# EAGLE schematic goJAMMAv02 (EAGLE 9.3.1)
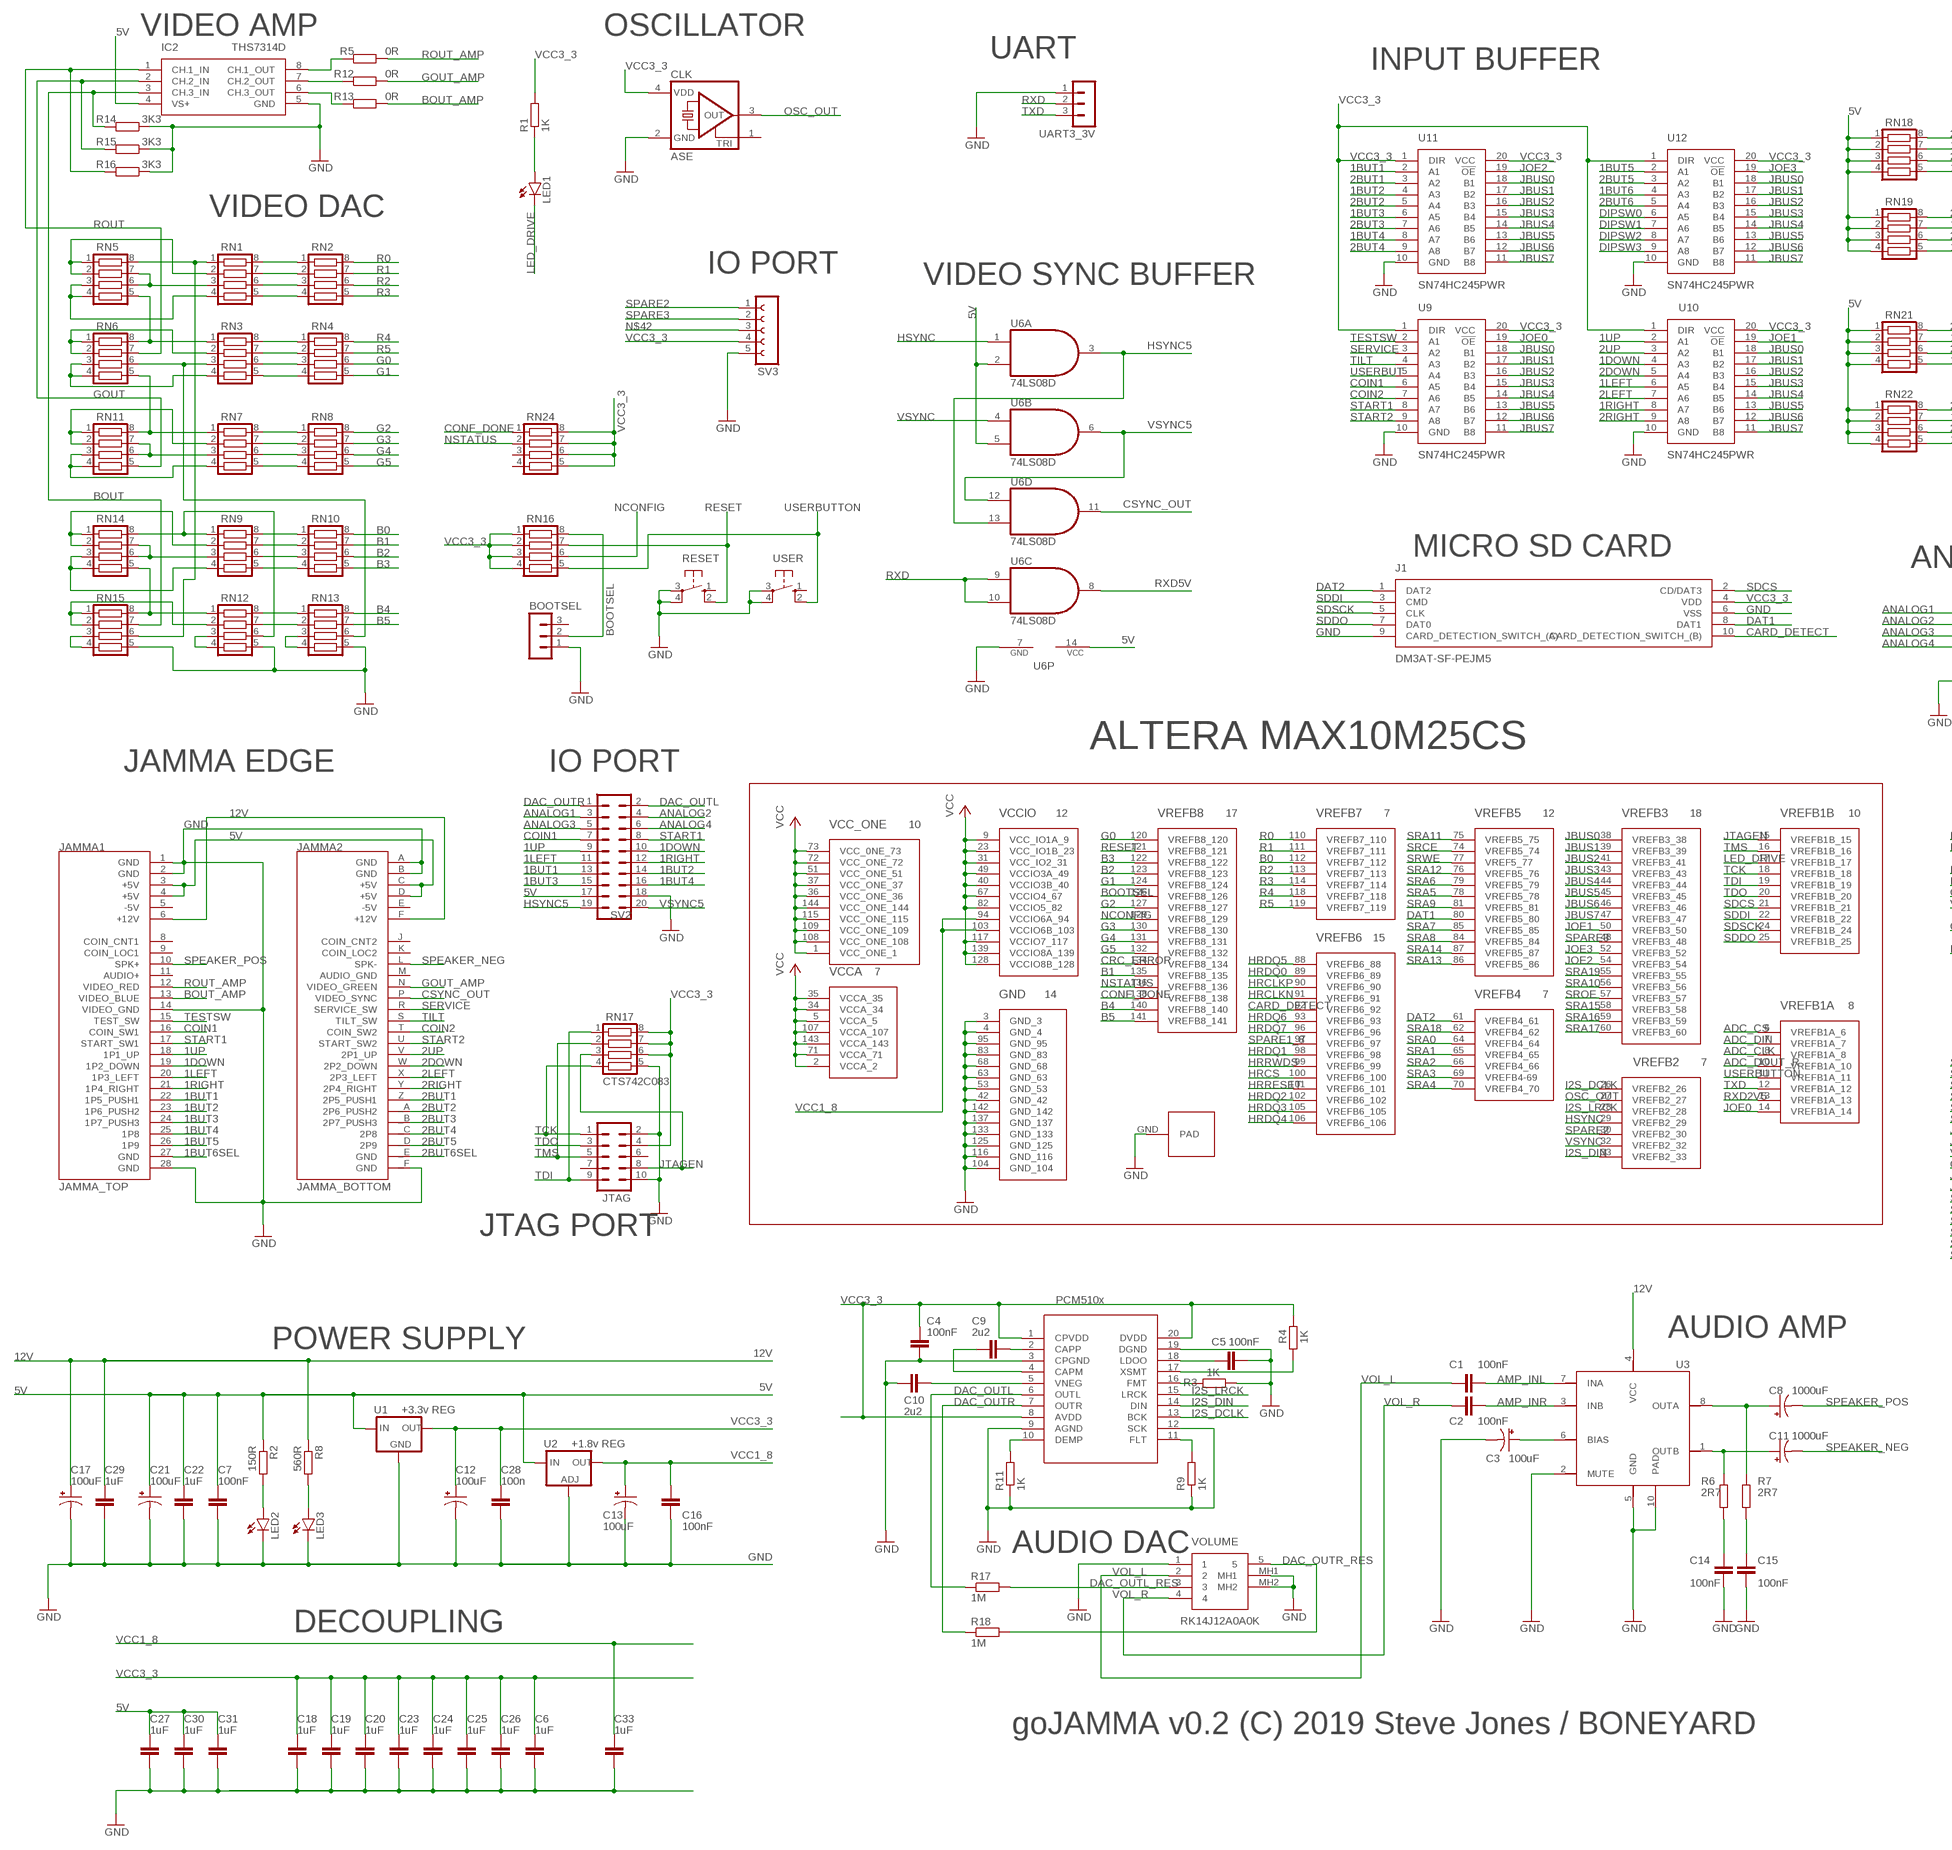
[diagram p0: schematic, sheet 1, part 1 of 2]
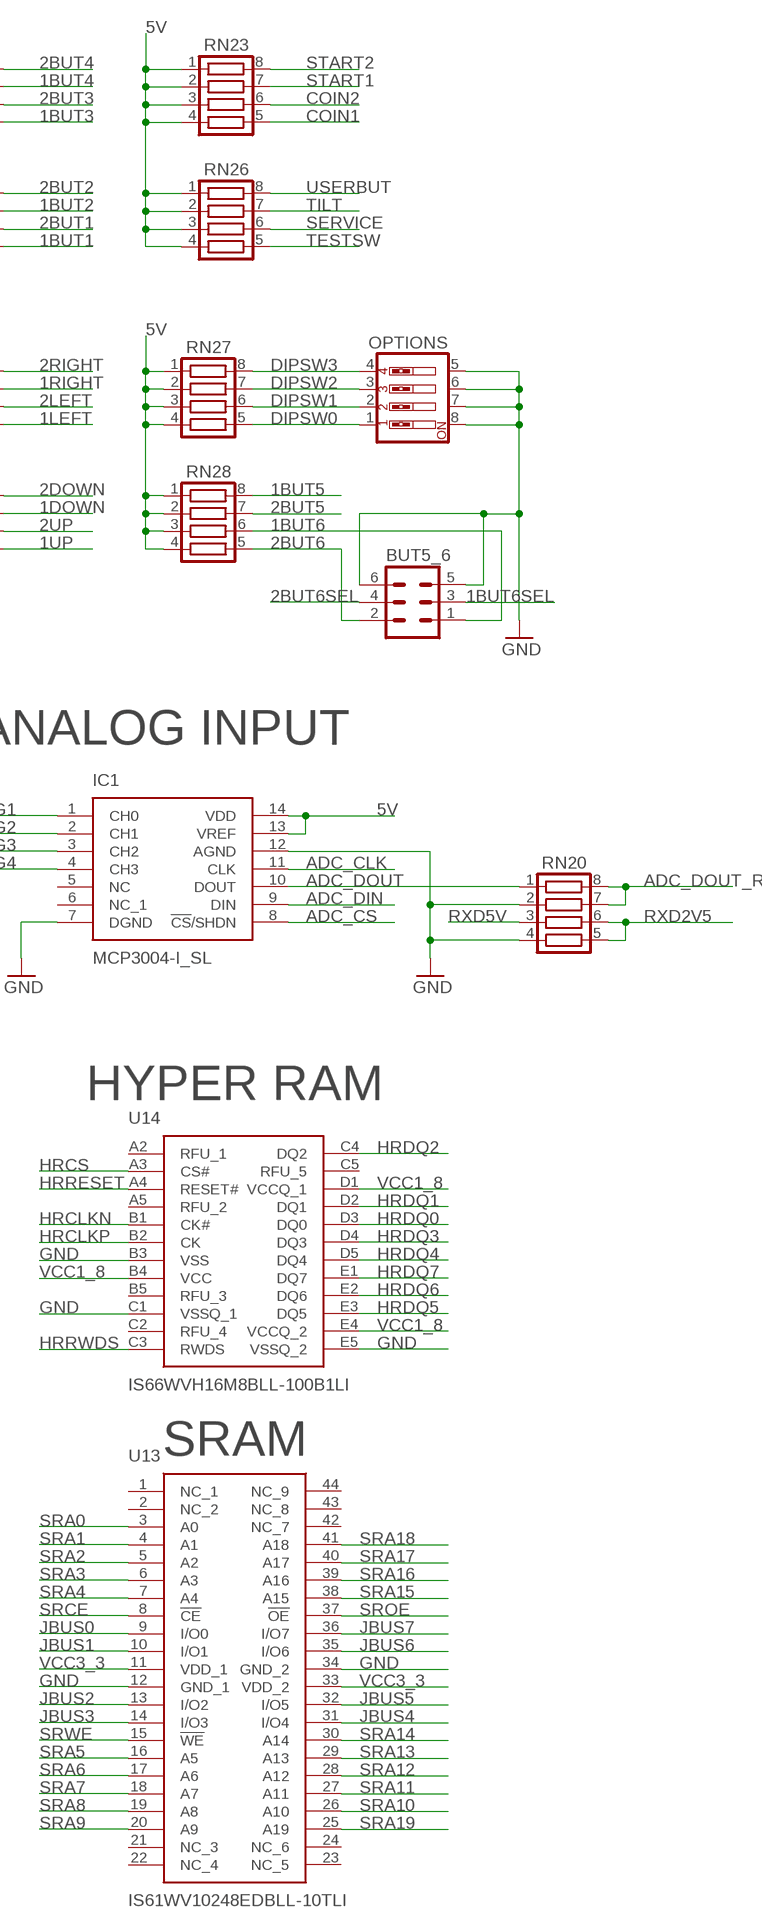
[diagram p1: schematic, sheet 1, part 2 of 2]

## Parts
BOOTSEL  MA03-1  [MA03-1]
BUT5_6  MA03-2  [MA03-2]
C1  100nF  C-EUC0805K  [C0805K]
C2  100nF  C-EUC0805K  [C0805K]
C3  100uF  100UF-POLAR-RADIAL-2.5MM-25V-20%  [CPOL-RADIAL-2.5MM-6.5MM]
C4  100nF  C-EUC0805K  [C0805K]
C5  100nF  C-EUC0805K  [C0805K]
C6  1uF  C-EUC0805K  [C0805K]
C7  100nF  C-EUC0805K  [C0805K]
C8  1000uF  1000UF-RADIAL-5MM-25V-20%  [CPOL-RADIAL-5MM-10MM]
C9  2u2  C-EUC0805K  [C0805K]
C10  2u2  C-EUC0805K  [C0805K]
C11  1000uF  1000UF-RADIAL-5MM-25V-20%  [CPOL-RADIAL-5MM-10MM]
C12  100uF  1000UF-RADIAL-5MM-25V-20%  [CPOL-RADIAL-5MM-10MM]
C13  100uF  1000UF-RADIAL-5MM-25V-20%  [CPOL-RADIAL-5MM-10MM]
C14  100nF  C-EUC0805K  [C0805K]
C15  100nF  C-EUC0805K  [C0805K]
C16  100nF  C-EUC0805K  [C0805K]
C17  100uF  1000UF-RADIAL-5MM-25V-20%  [CPOL-RADIAL-5MM-10MM]
C18  1uF  C-EUC0805K  [C0805K]
C19  1uF  C-EUC0805K  [C0805K]
C20  1uF  C-EUC0805K  [C0805K]
C21  100uF  1000UF-RADIAL-5MM-25V-20%  [CPOL-RADIAL-5MM-10MM]
C22  1uF  C-EUC0805K  [C0805K]
C23  1uF  C-EUC0805K  [C0805K]
C24  1uF  C-EUC0805K  [C0805K]
C25  1uF  C-EUC0805K  [C0805K]
C26  1uF  C-EUC0805K  [C0805K]
C27  1uF  C-EUC0805K  [C0805K]
C28  100n  C-EUC0805K  [C0805K]
C29  1uF  C-EUC0805K  [C0805K]
C30  1uF  C-EUC0805K  [C0805K]
C31  1uF  C-EUC0805K  [C0805K]
C33  1uF  C-EUC0805K  [C0805K]
CLK  ASE  [ASE]
IC1  MCP3004-I_SL  [SOIC127P600X175-14N]
IC2  THS7314D  [SOIC127P600X175-8N]
J1  DM3AT-SF-PEJM5  [DM3AT-SF-PEJM5_1]
JAMMA1  JAMMA_TOP  [JAMMA_TOP]
JAMMA2  JAMMA_BOTTOM  [JAMMA_BOTTOM]
JTAG  MA05-2  [MA05-2]
LED1  LEDCHIPLED_0805  [CHIPLED_0805]
LED2  LEDCHIPLED_0805  [CHIPLED_0805]
LED3  LEDCHIPLED_0805  [CHIPLED_0805]
OPTIONS  SW_DIP-4  [EDG-04]
R1  1K  R-EU_R0805  [R0805]
R2  150R  R-EU_R0805  [R0805]
R3  1K  R-EU_R0805  [R0805]
R4  1K  R-EU_R0805  [R0805]
R5  0R  R-EU_R0805  [R0805]
R6  2R7  R-EU_R0805  [R0805]
R7  2R7  R-EU_R0805  [R0805]
R8  560R  R-EU_R0805  [R0805]
R9  1K  R-EU_R0805  [R0805]
R11  1K  R-EU_R0805  [R0805]
R12  0R  R-EU_R0805  [R0805]
R13  0R  R-EU_R0805  [R0805]
R14  3K3  R-EU_R0805  [R0805]
R15  3K3  R-EU_R0805  [R0805]
R16  3K3  R-EU_R0805  [R0805]
R17  1M  R-EU_R0805  [R0805]
R18  1M  R-EU_R0805  [R0805]
RESET  10-XX  [B3F-10XX]
RN1  CTS742C083  [CTS742C083]
RN2  CTS742C083  [CTS742C083]
RN3  CTS742C083  [CTS742C083]
RN4  CTS742C083  [CTS742C083]
RN5  CTS742C083  [CTS742C083]
RN6  CTS742C083  [CTS742C083]
RN7  CTS742C083  [CTS742C083]
RN8  CTS742C083  [CTS742C083]
RN9  CTS742C083  [CTS742C083]
RN10  CTS742C083  [CTS742C083]
RN11  CTS742C083  [CTS742C083]
RN12  CTS742C083  [CTS742C083]
RN13  CTS742C083  [CTS742C083]
RN14  CTS742C083  [CTS742C083]
RN15  CTS742C083  [CTS742C083]
RN16  CTS742C083  [CTS742C083]
RN17  CTS742C083  [CTS742C083]
RN18  CTS742C083  [CTS742C083]
RN19  CTS742C083  [CTS742C083]
RN20  CTS742C083  [CTS742C083]
RN21  CTS742C083  [CTS742C083]
RN22  CTS742C083  [CTS742C083]
RN23  CTS742C083  [CTS742C083]
RN24  CTS742C083  [CTS742C083]
RN26  CTS742C083  [CTS742C083]
RN27  CTS742C083  [CTS742C083]
RN28  CTS742C083  [CTS742C083]
SV2  MA10-2  [MA10-2]
SV3  FE05-1  [FE05-1]
U1  +3.3v REG  V_REG_78XX7812  [TO-252]
U2  +1.8v REG  V_REG_LM1117SOT223  [SOT223]
U3  LM4755  [DDPAK-9]
U4  PCM5101  [TSSOP20]
U6  74LS08D  [SO14]
U8  ALTERA_MAX10M25SCPAD  [ALTERA_EQFP144]
U9  SN74HC245PWR  [SOP65P640X120-20N]
U10  SN74HC245PWR  [SOP65P640X120-20N]
U11  SN74HC245PWR  [SOP65P640X120-20N]
U12  SN74HC245PWR  [SOP65P640X120-20N]
U13  IS61WV10248EDBLL-10TLI  [SOP80P1176X120-44N]
U14  IS66WVH16M8BLL-100B1LI  [BGA24C100P5X5_600X800X120]
UART3_3V  MA03-1  [MA03-1]
USER  10-XX  [B3F-10XX]
VOLUME  RK14J12A0A0K  [RK14J12A0A0K]

## Nets
1BUT1: JAMMA1.22(1P5_PUSH1) RN19.5 SV2.13 U11.2(A1)
1BUT2: JAMMA1.23(1P6_PUSH2) RN19.7 SV2.14 U11.4(A3)
1BUT3: JAMMA1.24(1P7_PUSH3) RN18.5 SV2.15 U11.6(A5)
1BUT4: JAMMA1.25(1P8) RN18.7 SV2.16 U11.8(A7)
1BUT5: JAMMA1.26(1P9) RN28.8 U12.2(A1)
1BUT6: BUT5_6.1 RN28.6 U12.4(A3)
1BUT6SEL: BUT5_6.3 JAMMA1.27(GND)
1DOWN: JAMMA1.19(1P2_DOWN) RN22.7 SV2.10 U10.4(A3)
1LEFT: JAMMA1.20(1P3_LEFT) RN21.5 SV2.11 U10.6(A5)
1RIGHT: JAMMA1.21(1P4_RIGHT) RN21.7 SV2.12 U10.8(A7)
1UP: JAMMA1.18(1P1_UP) RN22.5 SV2.9 U10.2(A1)
2BUT1: JAMMA2.Z(2P5_PUSH1) RN19.6 U11.3(A2)
2BUT2: JAMMA2._A(2P6_PUSH2) RN19.8 U11.5(A4)
2BUT3: JAMMA2._B(2P7_PUSH3) RN18.6 U11.7(A6)
2BUT4: JAMMA2._C(2P8) RN18.8 U11.9(A8)
2BUT5: JAMMA2._D(2P9) RN28.7 U12.3(A2)
2BUT6: BUT5_6.2 RN28.5 U12.5(A4)
2BUT6SEL: BUT5_6.4 JAMMA2._E(GND)
2DOWN: JAMMA2.W(2P2_DOWN) RN22.8 U10.5(A4)
2LEFT: JAMMA2.X(2P3_LEFT) RN21.6 U10.7(A6)
2RIGHT: JAMMA2.Y(2P4_RIGHT) RN21.8 U10.9(A8)
2UP: JAMMA2.V(2P1_UP) RN22.6 U10.3(A2)
5V: C7.1 C21.+ C22.1 C27.1 C30.1 C31.1 IC1.13(VREF) IC1.14(VDD) IC2.4(VS+) JAMMA1.3(+5V) JAMMA1.4(+5V) JAMMA2.C(+5V) JAMMA2.D(+5V) R2.1 RN18.1 RN18.2 RN18.3 RN18.4 RN19.1 RN19.2 RN19.3 RN19.4 RN21.1 RN21.2 RN21.3 RN21.4 RN22.1 RN22.2 RN22.3 RN22.4 RN23.1 RN23.2 RN23.3 RN23.4 RN26.1 RN26.2 RN26.3 RN26.4 RN27.1 RN27.2 RN27.3 RN27.4 RN28.1 RN28.2 RN28.3 RN28.4 SV2.17 U1.1(IN) U2.3(IN) U6.2(A:I1) U6.5(B:I1) U6.14(P:VCC)
12V: C17.+ C29.1 JAMMA1.6(+12V) JAMMA2.F(+12V) R8.1 U3.4(VCC)
ADC_CLK: IC1.11(CLK) U8.8(VREFB1A_8)
ADC_CS: IC1.8(!CS!/SHDN) U8.6(VREFB1A_6)
ADC_DIN: IC1.9(DIN) U8.7(VREFB1A_7)
ADC_DOUT: IC1.10(DOUT) RN20.1
ADC_DOUT_R: RN20.7 RN20.8 U8.10(VREFB1A_10)
AMP_INL: C1.2 U3.7(INA)
AMP_INR: C2.2 U3.3(INB)
ANALOG1: IC1.1(CH0) SV2.3
ANALOG2: IC1.2(CH1) SV2.4
ANALOG3: IC1.3(CH2) SV2.5
ANALOG4: IC1.4(CH3) SV2.6
B0: RN10.8 U8.112(VREFB7_112)
B1: RN10.7 U8.135(VREFB8_135)
B2: RN10.6 U8.123(VREFB8_123)
B3: RN10.5 U8.122(VREFB8_122)
B4: RN13.8 U8.140(VREFB8_140)
B5: RN13.7 U8.141(VREFB8_141)
BOOTSEL: BOOTSEL.2 RN16.8 U8.126(VREFB8_126)
BOUT: IC2.3(CH.3_IN) R14.2 RN15.7
BOUT_AMP: JAMMA1.13(VIDEO_BLUE) R13.2
CARD_DETECT: J1.10(CARD_DETECTION_SWITCH_(B)) U8.92(VREFB6_92)
COIN1: JAMMA1.16(COIN_SW1) RN23.5 SV2.7 U9.6(A5)
COIN2: JAMMA2.T(COIN_SW2) RN23.6 U9.7(A6)
CONF_DONE: RN24.1 U8.138(VREFB8_138)
CRC_ERROR: U8.134(VREFB8_134)
CSYNC_OUT: JAMMA2.P(VIDEO_SYNC) U6.11(D:O)
DAC_OUTL: R17.1 SV2.2 U4.6(OUTL)
DAC_OUTL_RES: R17.2 VOLUME.3
DAC_OUTR: R18.1 SV2.1 U4.7(OUTR)
DAC_OUTR_RES: R18.2 VOLUME.5
DAT1: J1.8(DAT1) U8.80(VREFB5_80)
DAT2: J1.1(DAT2) U8.61(VREFB4_61)
DIPSW0: OPTIONS.1 RN27.5 U12.6(A5)
DIPSW1: OPTIONS.2 RN27.6 U12.7(A6)
DIPSW2: OPTIONS.3 RN27.7 U12.8(A7)
DIPSW3: OPTIONS.4 RN27.8 U12.9(A8)
G0: RN4.6 U8.120(VREFB8_120)
G1: RN4.5 U8.124(VREFB8_124)
G2: RN8.8 U8.127(VREFB8_127)
G3: RN8.7 U8.130(VREFB8_130)
G4: RN8.6 U8.131(VREFB8_131)
G5: RN8.5 U8.132(VREFB8_132)
GND: BOOTSEL.1 BUT5_6.5 BUT5_6.6 C3.2(-) C4.2 C5.2 C6.2 C7.2 C10.2 C12.- C13.- C14.2 C15.2 C16.2 C17.- C18.2 C19.2 C20.2 C21.- C22.2 C23.2 C24.2 C25.2 C26.2 C27.2 C28.2 C29.2 C30.2 C31.2 C33.2 CLK.2(GND) IC1.7(DGND) IC1.12(AGND) IC2.5(GND) J1.6(VSS) J1.9(CARD_DETECTION_SWITCH_(A)) JAMMA1.1(GND) JAMMA1.2(GND) JAMMA1.14(VIDEO_GND) JAMMA1.28(GND) JAMMA2._F(GND) JAMMA2.A(GND) JAMMA2.B(GND) JTAG.2 JTAG.10 LED2.C LED3.C OPTIONS.5 OPTIONS.6 OPTIONS.7 OPTIONS.8 R3.1 R9.1 R11.1 R14.1 R15.1 R16.1 RESET.3(P) RESET.4(P1) RN12.5 RN13.5 RN15.5 RN17.5 RN20.2 RN20.4 SV2.18 SV3.5 U1.3(GND) U2.1(ADJ) U3.2(MUTE) U3.5(GND) U3.10(PAD) U4.3(CPGND) U4.9(AGND) U4.12(SCK) U4.19(DGND) U6.7(P:GND) U8.3(GND_3) U8.4(GND_4) U8.42(GND_42) U8.53(GND_53) U8.63(GND_63) U8.68(GND_68) U8.83(GND_83) U8.95(GND_95) U8.104(GND_104) U8.116(GND_116) U8.125(GND_125) U8.133(GND_133) U8.137(GND_137) U8.142(GND_142) U8.GND(PAD) U9.10(GND) U10.10(GND) U11.10(GND) U12.10(GND) U13.12(GND_1) U13.34(GND_2) U14.B3(VSS) U14.C1(VSSQ_1) U14.E5(VSSQ_2) UART3_3V.1 USER.3(P) USER.4(P1) VOLUME.1 VOLUME.MH1 VOLUME.MH2
GOUT: IC2.2(CH.2_IN) R15.2 RN11.5
GOUT_AMP: JAMMA2.N(VIDEO_GREEN) R12.2
HRCLKN: U8.91(VREFB6_91) U14.B1(CK#)
HRCLKP: U8.90(VREFB6_90) U14.B2(CK)
HRCS: U8.100(VREFB6_100) U14.A3(CS#)
HRDQ0: U8.89(VREFB6_89) U14.D3(DQ0)
HRDQ1: U8.98(VREFB6_98) U14.D2(DQ1)
HRDQ2: U8.102(VREFB6_102) U14.C4(DQ2)
HRDQ3: U8.105(VREFB6_105) U14.D4(DQ3)
HRDQ4: U8.106(VREFB6_106) U14.D5(DQ4)
HRDQ5: U8.88(VREFB6_88) U14.E3(DQ5)
HRDQ6: U8.93(VREFB6_93) U14.E2(DQ6)
HRDQ7: U8.96(VREFB6_96) U14.E1(DQ7)
HRRESET: U8.101(VREFB6_101) U14.A4(RESET#)
HRRWDS: U8.99(VREFB6_99) U14.C3(RWDS)
HSYNC: U6.1(A:I0) U8.29(VREFB2_29)
HSYNC5: SV2.19 U6.3(A:O) U6.13(D:I1)
I2S_DCLK: U4.13(BCK) U8.26(VREFB2_26)
I2S_DIN: U4.14(DIN) U8.33(VREFB2_33)
I2S_LRCK: U4.15(LRCK) U8.28(VREFB2_28)
JBUS0: U8.38(VREFB3_38) U9.18(B1) U10.18(B1) U11.18(B1) U12.18(B1) U13.9(I/O0)
JBUS1: U8.39(VREFB3_39) U9.17(B2) U10.17(B2) U11.17(B2) U12.17(B2) U13.10(I/O1)
JBUS2: U8.41(VREFB3_41) U9.16(B3) U10.16(B3) U11.16(B3) U12.16(B3) U13.13(I/O2)
JBUS3: U8.43(VREFB3_43) U9.15(B4) U10.15(B4) U11.15(B4) U12.15(B4) U13.14(I/O3)
JBUS4: U8.44(VREFB3_44) U9.14(B5) U10.14(B5) U11.14(B5) U12.14(B5) U13.31(I/O4)
JBUS5: U8.45(VREFB3_45) U9.13(B6) U10.13(B6) U11.13(B6) U12.13(B6) U13.32(I/O5)
JBUS6: U8.46(VREFB3_46) U9.12(B7) U10.12(B7) U11.12(B7) U12.12(B7) U13.35(I/O6)
JBUS7: U8.47(VREFB3_47) U9.11(B8) U10.11(B8) U11.11(B8) U12.11(B8) U13.36(I/O7)
JOE0: U8.14(VREFB1A_14) U9.19(!OE)
JOE1: U8.50(VREFB3_50) U10.19(!OE)
JOE2: U8.54(VREFB3_54) U11.19(!OE)
JOE3: U8.52(VREFB3_52) U12.19(!OE)
JTAGEN: JTAG.8 RN17.3 U8.15(VREFB1B_15)
LED_DRIVE: LED1.C U8.17(VREFB1B_17)
N$1: RN1.8 RN2.1
N$3: C8.+ R7.2 U3.8(OUTA)
N$4: RN1.7 RN2.2
N$5: RN1.6 RN2.3
N$6: RN1.5 RN2.4
N$7: RN3.8 RN4.1
N$8: RN3.7 RN4.2
N$9: RN7.8 RN8.1
N$10: RN7.7 RN8.2
N$11: RN7.6 RN8.3
N$12: RN7.5 RN8.4
N$13: RN6.5 RN7.1 RN11.8
N$14: RN9.8 RN10.1
N$15: RN1.1 RN5.8 RN15.6
N$16: RN1.2 RN5.1 RN5.2
N$17: RN1.3 RN5.6 RN5.7
N$18: RN1.4 RN5.3 RN5.4
N$19: RN3.1 RN5.5 RN6.8
N$20: RN3.2 RN6.1 RN6.2
N$21: RN9.7 RN10.2
N$22: RN7.2 RN11.1 RN11.2
N$23: RN7.3 RN11.6 RN11.7
N$24: RN7.4 RN11.3 RN11.4
N$25: RN9.6 RN10.3
N$26: RN9.5 RN10.4
N$27: RN3.4 RN6.3 RN6.4
N$28: RN12.8 RN13.1
N$29: RN3.6 RN4.3
N$30: RN3.5 RN4.4
N$31: RN3.3 RN6.6 RN13.6
N$32: RN12.7 RN13.2
N$33: RN9.1 RN12.6 RN14.8
N$34: RN9.2 RN14.1 RN14.2
N$35: RN9.3 RN14.6 RN14.7
N$36: RN9.4 RN14.3 RN14.4
N$37: RN12.1 RN14.5 RN15.8
N$38: RN12.2 RN15.1 RN15.2
N$39: RN15.3 RN15.4
N$40: RN12.3 RN12.4
N$41: RN13.3 RN13.4
N$42: SV3.3
N$43: R3.2 U4.16(FMT)
N$47: IC2.8(CH.1_OUT) R5.1
N$48: LED1.A R1.1
N$49: IC2.7(CH.2_OUT) R12.1
N$50: IC2.6(CH.3_OUT) R13.1
N$52: LED2.A R2.2
N$53: LED3.A R8.2
N$55: C9.2 U4.2(CAPP)
N$57: C9.1 U4.4(CAPM)
N$58: C11.+ R6.2 U3.1(OUTB)
N$59: C3.1(+) U3.6(BIAS)
N$61: C14.1 R6.1
N$62: C15.1 R7.1
N$66: C10.1 U4.5(VNEG)
N$78: R4.1 U4.17(XSMT)
N$80: R11.2 U4.10(DEMP)
N$81: R9.2 U4.11(FLT)
N$82: C5.1 U4.18(LDOO)
NCONFIG: RN16.6 U8.129(VREFB8_129)
NSTATUS: RN24.2 U8.136(VREFB8_136)
OSC_OUT: CLK.3(OUT) U8.27(VREFB2_27)
R0: RN2.8 U8.110(VREFB7_110)
R1: RN2.7 U8.111(VREFB7_111)
R2: RN2.6 U8.113(VREFB7_113)
R3: RN2.5 U8.114(VREFB7_114)
R4: RN4.8 U8.118(VREFB7_118)
R5: RN4.7 U8.119(VREFB7_119)
RESET: RESET.2(S1) RN16.7 U8.121(VREFB8_121)
ROUT: IC2.1(CH.1_IN) R16.2 RN6.7
ROUT_AMP: JAMMA1.12(VIDEO_RED) R5.2
RXD: U6.9(C:I0) U6.10(C:I1) UART3_3V.2
RXD2V5: RN20.5 RN20.6 U8.13(VREFB1A_13)
RXD5V: RN20.3 U6.8(C:O)
SDCS: J1.2(CD/DAT3) U8.21(VREFB1B_21)
SDDI: J1.3(CMD) U8.22(VREFB1B_22)
SDDO: J1.7(DAT0) U8.25(VREFB1B_25)
SDSCK: J1.5(CLK) U8.24(VREFB1B_24)
SERVICE: JAMMA2.R(SERVICE_SW) RN26.6 U9.3(A2)
SPARE1_8: U8.97(VREFB6_97)
SPARE2: SV3.1 U8.30(VREFB2_30)
SPARE3: SV3.2 U8.48(VREFB3_48)
SPEAKER_NEG: C11.- JAMMA2.L(SPK-)
SPEAKER_POS: C8.- JAMMA1.10(SPK+)
SRA0: U8.64(VREFB4_64) U13.3(A0)
SRA1: U8.65(VREFB4_65) U13.4(A1)
SRA2: U8.66(VREFB4_66) U13.5(A2)
SRA3: U8.69(VREFB4-69) U13.6(A3)
SRA4: U8.70(VREFB4_70) U13.7(A4)
SRA5: U8.78(VREFB5_78) U13.16(A5)
SRA6: U8.79(VREFB5_79) U13.17(A6)
SRA7: U8.85(VREFB5_85) U13.18(A7)
SRA8: U8.84(VREFB5_84) U13.19(A8)
SRA9: U8.81(VREFB5_81) U13.20(A9)
SRA10: U8.56(VREFB3_56) U13.26(A10)
SRA11: U8.75(VREFB5_75) U13.27(A11)
SRA12: U8.76(VREFB5_76) U13.28(A12)
SRA13: U8.86(VREFB5_86) U13.29(A13)
SRA14: U8.87(VREFB5_87) U13.30(A14)
SRA15: U8.58(VREFB3_58) U13.38(A15)
SRA16: U8.59(VREFB3_59) U13.39(A16)
SRA17: U8.60(VREFB3_60) U13.40(A17)
SRA18: U8.62(VREFB4_62) U13.41(A18)
SRA19: U8.55(VREFB3_55) U13.25(A19)
SRCE: U8.74(VREFB5_74) U13.8(!CE)
SROE: U8.57(VREFB3_57) U13.37(!OE)
SRWE: U8.77(VREF5_77) U13.15(!WE)
START1: JAMMA1.17(START_SW1) RN23.7 SV2.8 U9.8(A7)
START2: JAMMA2.U(START_SW2) RN23.8 U9.9(A8)
TCK: JTAG.1 RN17.4 U8.18(VREFB1B_18)
TDI: JTAG.9 RN17.1 U8.19(VREFB1B_19)
TDO: JTAG.3 U8.20(VREFB1B_20)
TESTSW: JAMMA1.15(TEST_SW) RN26.5 U9.2(A1)
TILT: JAMMA2.S(TILT_SW) RN26.7 U9.4(A3)
TMS: JTAG.5 RN17.2 U8.16(VREFB1B_16)
TXD: U8.12(VREFB1A_12) UART3_3V.3
USERBUT: RN26.8 U9.5(A4)
USERBUTTON: RN16.5 U8.11(VREFB1A_11) USER.2(S1)
VCC1_8: C13.+ C16.1 C33.1 U2.2(OUT) U2.4(OUT) U8.94(VCCIO6A_94) U8.103(VCCIO6B_103) U14.B4(VCC) U14.D1(VCCQ_1) U14.E4(VCCQ_2)
VCC3_3: C4.1 C6.1 C12.+ C18.1 C19.1 C20.1 C23.1 C24.1 C25.1 C26.1 C28.1 CLK.4(VDD) J1.4(VDD) JTAG.4 R1.2 R4.2 RN16.1 RN16.2 RN16.3 RN16.4 RN17.6 RN17.7 RN17.8 RN24.5 RN24.6 RN24.7 RN24.8 SV3.4 U1.2(OUT) U4.1(CPVDD) U4.8(AVDD) U4.20(DVDD) U8.1(VCC_ONE_1) U8.2(VCCA_2) U8.5(VCCA_5) U8.9(VCC_IO1A_9) U8.23(VCC_IO1B_23) U8.31(VCC_IO2_31) U8.34(VCCA_34) U8.35(VCCA_35) U8.36(VCC_ONE_36) U8.37(VCC_ONE_37) U8.40(VCCIO3B_40) U8.49(VCCIO3A_49) U8.51(VCC_ONE_51) U8.67(VCCIO4_67) U8.71(VCCA_71) U8.72(VCC_ONE_72) U8.73(VCC_0NE_73) U8.82(VCCIO5_82) U8.107(VCCA_107) U8.108(VCC_ONE_108) U8.109(VCC_ONE_109) U8.115(VCC_ONE_115) U8.117(VCCIO7_117) U8.128(VCCIO8B_128) U8.139(VCCIO8A_139) U8.143(VCCA_143) U8.144(VCC_ONE_144) U9.1(DIR) U9.20(VCC) U10.1(DIR) U10.20(VCC) U11.1(DIR) U11.20(VCC) U12.1(DIR) U12.20(VCC) U13.11(VDD_1) U13.33(VDD_2) ; supply symbol labelled VCC
VOL_L: C1.1 VOLUME.2
VOL_R: C2.1 VOLUME.4
VSYNC: U6.4(B:I0) U8.32(VREFB2_32)
VSYNC5: SV2.20 U6.6(B:O) U6.12(D:I0)
Unconnected: BOOTSEL.3 CLK.1(TRI) IC1.5(NC) IC1.6(NC_1) JAMMA1.8(COIN_CNT1) JAMMA1.9(COIN_LOC1) JAMMA1.11(AUDIO+) JAMMA2.J(COIN_CNT2) JAMMA2.K(COIN_LOC2) JAMMA2.M(AUDIO_GND) JTAG.6 JTAG.7 RESET.1(S) RN24.3 RN24.4 U13.1(NC_1) U13.2(NC_2) U13.21(NC_3) U13.22(NC_4) U13.23(NC_5) U13.24(NC_6) U13.42(NC_7) U13.43(NC_8) U13.44(NC_9) U14.A2(RFU_1) U14.A5(RFU_2) U14.B5(RFU_3) U14.C2(RFU_4) U14.C5(RFU_5) USER.1(S)

## Notes on the sheet
- VIDEO AMP | OSCILLATOR
- UART
- INPUT BUFFER
- VIDEO DAC
- IO PORT
- VIDEO SYNC BUFFER
- MICRO SD CARD
- ANALOG INPUT
- JAMMA EDGE | IO PORT
- HYPER RAM
- SRAM
- JTAG PORT
- AUDIO AMP
- POWER SUPPLY
- AUDIO DAC
- DECOUPLING
- goJAMMA v0.2 (C) 2019 Steve Jones / BONEYARD

## Power pins joined to a net without a drawn wire
-5V: JAMMA1.5(-5V) JAMMA2.E(-5V)

## Library data of the parts
BOOTSEL UART3_3V = con-lstb:MA03-1: PIN HEADER; OC_FARNELL: unknown; OC_NEWARK: unknown
BUT5_6 = con-lstb:MA03-2: PIN HEADER; OC_FARNELL: unknown; OC_NEWARK: unknown
C1 C2 C4-C7 C9 C10 C14-C16 C18-C20 C22-C31 C33 = rcl:C-EU: CAPACITOR, European symbol
C3 = SparkFun-Capacitors:100UF-POLAR: 100µF polarized capacitors A capacitor is a passive two-terminal electrical component used to store electrical energy temporarily in an electric field.; PROD_ID: CAP-08439
C8 C11-C13 C17 C21 = SparkFun-Capacitors:1000UF: 1,000µF/1mF ceramic capacitors A capacitor is a passive two-terminal electrical component used to store electrical energy temporarily in an electric field. CAP-08070; PROD_ID: CAP-09538; VALUE: 1mF
CLK = crystal:ASE: 3.3Vdc CMOS SMD CRYSTAL CLOCK OSCILLATOR SOurce: www.abracon.com; OC_FARNELL: unknown; OC_NEWARK: unknown
IC1 = SamacSys_Parts:MCP3004-I_SL: A/D Converter 10Bit 4-ch 2.7V SPI SOIC14 Source: Datasheet <http://www.mouser.com/datasheet/2/268/21295b-72710.pdf>; DESCRIPTION: A/D Converter 10Bit 4-ch 2.7V SPI SOIC14; HEIGHT: 1.75mm; MANUFACTURER_NAME: Microchip; MANUFACTURER_PART_NUMBER: MCP3004-I/SL; MOUSER_PART_NUMBER: 579-MCP3004-I/SL; MOUSER_PRICE-STOCK: https://www.mouser.com/Search/Refine.aspx?Keyword=579-MCP3004-I%2FSL
IC2 = SamacSys_Parts:THS7314D: Video Amp Triple 3.3V/5V 8-Pin SOIC THS7314D, Video Amplifier 3-channel, 8-Pin SOIC Source: Datasheet; DESCRIPTION: Video Amp Triple 3.3V/5V 8-Pin SOIC THS7314D, Video Amplifier 3-channel, 8-Pin SOIC; HEIGHT: 1.75mm; MANUFACTURER_NAME: Texas Instruments; MANUFACTURER_PART_NUMBER: THS7314D; MOUSER_PART_NUMBER: 595-THS7314D; MOUSER_PRICE-STOCK: https://www.mouser.com/Search/Refine.aspx?Keyword=595-THS7314D
J1 = SamacSys_Parts:DM3AT-SF-PEJM5: DM3 RA SMT microSD memory card push/push DM3 RA SMT microSD memory card push/push Source: Datasheet <https://componentsearchengine.com/Datasheets/1/DM3AT-SF-PEJM5.pdf>; DESCRIPTION: DM3 RA SMT microSD memory card push/push DM3 RA SMT microSD memory card push/push; HEIGHT: mm; MANUFACTURER_NAME: Hirose; MANUFACTURER_PART_NUMBER: DM3AT-SF-PEJM5; MOUSER_PART_NUMBER: 798-DM3AT-SF-PEJM5; MOUSER_PRICE-STOCK: https://www.mouser.com/Search/Refine.aspx?Keyword=798-DM3AT-SF-PEJM5
JAMMA1 = JAMMA:JAMMA_TOP: JAMMA Connector Top Parts side for these card-edge connenctors HIROSE CR7E-56DA-3.96E HIROSE CR7E-56DB-3.96E KEL 1168-056-009
JAMMA2 = JAMMA:JAMMA_BOTTOM: JAMMA Connector Bottom Solder side for these card-edge connenctors HIROSE CR7E-56DA-3.96E HIROSE CR7E-56DB-3.96E KEL 1168-056-009
JTAG = con-lstb:MA05-2: PIN HEADER; OC_FARNELL: unknown; OC_NEWARK: unknown
LED1-LED3 = led:LED: LED OSRAM: - CHIPLED LG R971, LG N971, LY N971, LG Q971, LY Q971, LO R971, LY R971 LH N974, LH R974 LS Q976, LO Q976, LY Q976 LO Q996 - Hyper CHIPLED LW Q18S LB Q993, LB Q99A, LB R99A - SideLED LS A670, LO A670, LY A670, LG A670, LP A670 LB A673, LV A673, LT A673, LW A673 LH A674 LY A675 LS A676, LA A676, LO A676, LY A676, LW A676 LS A679, LY A679, LG A679 - Hyper Micro SIDELED® LS Y876, LA Y876, LO Y876, LY Y876 LT Y87S - SmartLED LW L88C, LW L88S LB L89C, LB L89S, LG L890 LS L89K, LO L89K, LY L89K LS L896, LA L896, LO L896, LY L896 - TOPLED LS T670, LO T670, LY T670, LG T670, LP T670 LSG T670, LSP T670, LSY T670, LOP T670, LYG T670 LG T671, LOG T671, LSG T671 LB T673, LV T673, LT T673, LW T673 LH T674 LS T676, LA T676, LO T676, LY T676, LB T676, LH T676, LSB T676, LW T676 LB T67C, LV T67C, LT T67C, LS T67K, LO T67K, LY T67K, LW E67C LS E67B, LA E67B, LO E67B, LY E67B, LB E67C, LV E67C, LT E67C LW T67C LS T679, LY T679, LG T679 LS T770, LO T770, LY T770, LG T770, LP T770 LB T773, LV T773, LT T773, LW T773 LH T774 LS E675, LA E675, LY E675, LS T675 LS T776, LA T776, LO T776, LY T776, LB T776 LHGB T686 LT T68C, LB T68C - Hyper Mini TOPLED® LB M676 - Mini TOPLED Santana® LG M470 LS M47K, LO M47K, LY M47K Source: http://www.osram.convergy.de LUXEON: - LUMILED® LXK2-PW12-R00, LXK2-PW12-S00, LXK2-PW14-U00, LXK2-PW14-V00 LXK2-PM12-R00, LXK2-PM12-S00, LXK2-PM14-U00 LXK2-PE12-Q00, LXK2-PE12-R00, LXK2-PE12-S00, LXK2-PE14-T00, LXK2-PE14-U00 LXK2-PB12-K00, LXK2-PB12-L00, LXK2-PB12-M00, LXK2-PB14-N00, LXK2-PB14-P00, LXK2-PB14-Q00 LXK2-PR12-L00, LXK2-PR12-M00, LXK2-PR14-Q00, LXK2-PR14-R00 LXK2-PD12-Q00, LXK2-PD12-R00, LXK2-PD12-S00 LXK2-PH12-R00, LXK2-PH12-S00 LXK2-PL12-P00, LXK2-PL12-Q00, LXK2-PL12-R00 Source: www.luxeon.com KINGBRIGHT: KA-3528ASYC Source: www.kingbright.com
OPTIONS = special:SW_DIP-4: DIP SWITCH
R1-R9 R11-R18 = rcl:R-EU_: RESISTOR, European symbol
RESET USER = switch-omron:10-XX: OMRON SWITCH; MPN: B3F-1000; OC_FARNELL: 176432; OC_NEWARK: 36M3542
RN1-RN24 RN26-RN28 = resistor-net:CTS742C083: Chip Resistor Array 4 Single Resistor Source: http://www.ctscorp.com/components/Datasheets/CTSChipArrayDs.pdf; OC_FARNELL: unknown; OC_NEWARK: unknown
SV2 = con-lstb:MA10-2: PIN HEADER; OC_FARNELL: unknown; OC_NEWARK: unknown
SV3 = con-lsta:FE05-1: FEMALE HEADER; OC_FARNELL: unknown; OC_NEWARK: unknown
U1 = SparkFun-IC-Power:V_REG_78XX: Voltage Regulator Standard 78xx regulator. IGO (Input Ground Output). Spark Fun Electronics SKU : COM-00107; PROD_ID: VREG-12370; VALUE: +12v
U2 = SparkFun-IC-Power:V_REG_LM1117: Voltage Regulator LM1117 Standard adjustable voltage regulator but in SMD form. Spark Fun Electronics SKU : COM-00595; PROD_ID: VREG-08170
U3 = jammaFPGA:LM4755: LM4755 AUDIO AMP
U4 = cronic:PCM5101
U6 = 74xx-us:74*08: Quad 2-input AND gate
U8 = MAX10M25SC_test1:ALTERA_MAX10M25SCPAD
U9-U12 = SamacSys_Parts:SN74HC245PWR: Octal Bus Transceivers With 3-State Outputs Source: Datasheet <http://www.ti.com/lit/gpn/sn74hc245>; DESCRIPTION: Octal Bus Transceivers With 3-State Outputs; HEIGHT: 1.2mm; MANUFACTURER_NAME: Texas Instruments; MANUFACTURER_PART_NUMBER: SN74HC245PWR; MOUSER_PART_NUMBER: 595-SN74HC245PWR
U13 = SamacSys_Parts:IS61WV10248EDBLL-10TLI: SRAM 8M, 2.4V-3.6V, 10ns LP Async SRAM Source: Datasheet <https://componentsearchengine.com/Datasheets/1/IS61WV10248EDBLL-10TLI.pdf>; DESCRIPTION: SRAM 8M, 2.4V-3.6V, 10ns LP Async SRAM; HEIGHT: 1.2mm; MANUFACTURER_NAME: Integrated Silicon Solution Inc.; MANUFACTURER_PART_NUMBER: IS61WV10248EDBLL-10TLI; MOUSER_PART_NUMBER: 870-61WV10EDBLL10TLI
U14 = SamacSys_Parts:IS66WVH16M8BLL-100B1LI: DRAM 128Mb 16Mbx8 3.0V 100MHz HyperRAM Source: Datasheet <https://componentsearchengine.com/Datasheets/1/IS66WVH16M8BLL-100B1LI.pdf>; DESCRIPTION: DRAM 128Mb 16Mbx8 3.0V 100MHz HyperRAM; HEIGHT: 1.2mm; MANUFACTURER_NAME: Integrated Silicon Solution Inc.; MANUFACTURER_PART_NUMBER: IS66WVH16M8BLL-100B1LI; MOUSER_PART_NUMBER: 870-WVH16M8BL100B1LI
VOLUME = SamacSys_Parts:RK14J12A0A0K: Potentiometers Dual Unit 14mm 3B insertion (2mm) Source: Datasheet <http://www.mouser.com/datasheet/2/15/RKJ1-1370680.pdf>; DESCRIPTION: Potentiometers Dual Unit 14mm 3B insertion (2mm); HEIGHT: 2.5mm; MANUFACTURER_NAME: ALPS; MANUFACTURER_PART_NUMBER: RK14J12A0A0K; MOUSER_PART_NUMBER: 688-RK14J12A0A0K; MOUSER_PRICE-STOCK: https://www.mouser.com/Search/Refine.aspx?Keyword=688-RK14J12A0A0K